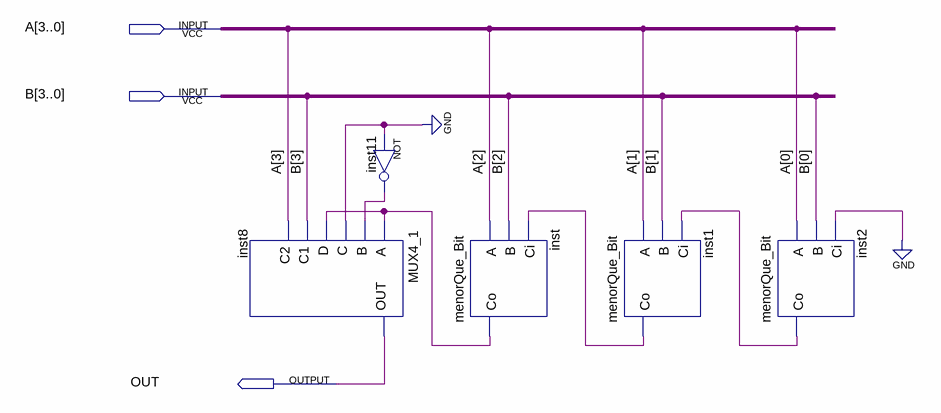
[diagram p0: schematic sheet]
// Quartus schematic menorQue.bdf as structural Verilog: 5 symbols, 3 pins
module menorQue (
  input  [3:0] A,
  input  [3:0] B,
  output OUT
);

  wire inst1_co, inst2_co, inst11_out, inst_co;

  MUX4_1 inst8 (.A(inst_co), .B(inst11_out), .C(1'b0), .D(inst_co), .C1(B[3]), .C2(A[3]), .OUT(OUT));
  not inst11 (inst11_out, 1'b0);
  menorQue_Bit inst (.A(A[2]), .B(B[2]), .Ci(inst1_co), .Co(inst_co));
  menorQue_Bit inst1 (.A(A[1]), .B(B[1]), .Ci(inst2_co), .Co(inst1_co));
  menorQue_Bit inst2 (.A(A[0]), .B(B[0]), .Ci(1'b0), .Co(inst2_co));
endmodule
